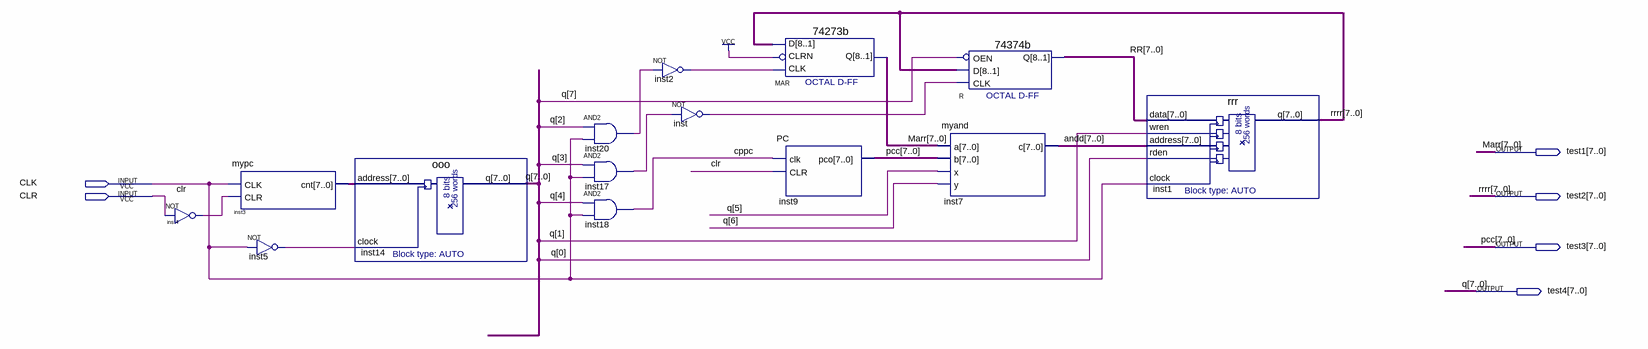
[diagram p0: schematic sheet]
// Quartus schematic 22.bdf as structural Verilog: 14 symbols, 6 pins
module \22  (
  input  CLK,
  input  CLR,
  output [7:0] test1,
  output [7:0] test2,
  output [7:0] test3,
  output [7:0] test4
);

  wire cppc, inst2_out, inst4_out, inst5_out, inst17_out, inst20_out, inst_out;
  wire [7:0] andd, inst3_cnt, RR;

  not inst4 (inst4_out, CLR);
  mypc inst3 (.CLK(CLK), .CLR(inst4_out), .cnt(inst3_cnt));
  not inst5 (inst5_out, CLK);
  ooo inst14 (.address(inst3_cnt), .clock(inst5_out), .q(test4));
  and inst20 (inst20_out, test4[2], CLK);
  and inst17 (inst17_out, test4[3], CLK);
  and inst18 (cppc, test4[4], CLK);
  not inst2 (inst2_out, inst20_out);
  not inst (inst_out, inst17_out);
  \74273b  MAR (.CLK(inst2_out), .D(test2), .CLRN(1'b1), .Q(test1));
  PC inst9 (.clk(cppc), .CLR(CLR), .pco(test3));
  myand inst7 (.a(test1), .b(test3), .x(test4[5]), .y(test4[6]), .c(andd));
  \74374b  R (.D(test2), .OEN(test4[7]), .CLK(inst_out), .Q(RR));
  rrr inst1 (.data(RR), .wren(test4[1]), .address(andd), .rden(test4[0]), .clock(CLK), .q(test2));

  // Other names for the same wires on the sheet: Marr[7:0] = test1; pcc[7:0] = test3; q[7:0] = test4;
  //   rrrr[7:0] = test2
endmodule
